# Altium schematic sheet +-15V.SchDoc
size A2
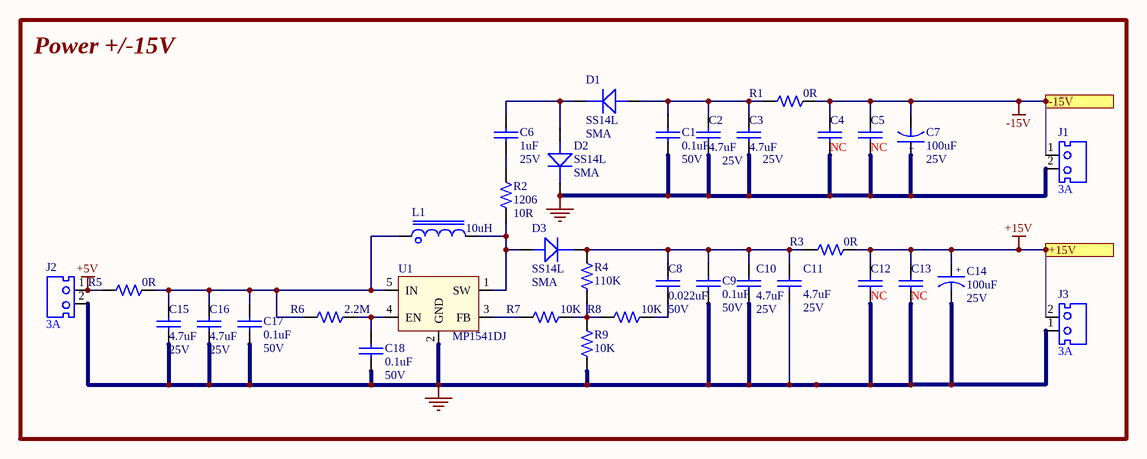
[diagram p0: +-15V.SchDoc]

## Parts
C1  value 0.1uF  Voltage: 50V  [CAPC0603-RW]  (hidden comment: T542021047508)
C2  value 4.7uF  Voltage: 25V  [CAPC0603-RW]  (hidden comment: T542024757408)
C3  value 4.7uF  Voltage: 25V  [CAPC0603-RW]  (hidden comment: T542024757408)
C4  value NC  [CAPC0603-RW]  (hidden comment: T542024757408)
C5  value NC  [CAPC0603-RW]  (hidden comment: CAP0603 NC)
C6  value 1uF  Voltage: 25V  [CAPC1206-RW]  (hidden comment: PZL456450-1050)
C7  value 100uF  Voltage: 25V  [CASE - D8]  (hidden comment: T551101445020)
C8  value 0.022uF  Voltage: 50V  [CAPC0603-RW]  (hidden comment: PXL456470-2230)
C9  value 0.1uF  Voltage: 50V  [CAPC0603-RW]  (hidden comment: T542021047508)
C10  value 4.7uF  Voltage: 25V  [CAPC0603-RW]  (hidden comment: T542024757408)
C11  value 4.7uF  Voltage: 25V  [CAPC0603-RW]  (hidden comment: T542024757408)
C12  value NC  [CAPC0603-RW]  (hidden comment: T542024757408)
C13  value NC  [CAPC0603-RW]  (hidden comment: T542024757408)
C14  value 100uF  Voltage: 25V  [CASE - D8]  (hidden comment: T551101445020)
C15  value 4.7uF  Voltage: 25V  [CAPC0603-RW]  (hidden comment: T542024757408)
C16  value 4.7uF  Voltage: 25V  [CAPC0603-RW]  (hidden comment: T542024757408)
C17  value 0.1uF  Voltage: 50V  [CAPC0603-RW]  (hidden comment: T542021047508)
C18  value 0.1uF  Voltage: 50V  [CAPC0603-RW]  (hidden comment: T542021047508)
D1  MFG Part: SS14L  Package: SMA  [subSMA]  (hidden comment: RCD100140-0010)
D2  MFG Part: SS14L  Package: SMA  [subSMA]  (hidden comment: RCD100140-0010)
D3  MFG Part: SS14L  Package: SMA  [subSMA]  (hidden comment: RCD100140-0010)
J1  Current: 3A  [CONN 2P PH=2.5mm B2B-XH-A]  (hidden comment: CCN250000-0102)
J2  Current: 3A  [CONN 2P PH=2.5mm B2B-XH-A]  (hidden comment: CCN250000-0102)
J3  Current: 3A  [CONN 2P PH=2.5mm B2B-XH-A]  (hidden comment: CCN250000-0102)
L1  value 10uH  [IND CKST0402]  (hidden comment: T621000053100)
R1  value 0R  [0805-RW]  (hidden comment: T502000003009)
R2  value 10R  PACKAGE: 1206  [1206-RW]  (hidden comment: QCF045010-1000)
R3  value 0R  [0805-RW]  (hidden comment: T502000003009)
R4  value 110K  [0603-RW]  (hidden comment: QCF011030-1103)
R5  value 0R  [0805-RW]  (hidden comment: T502000003009)
R6  value 2.2M  [0603-RW]  (hidden comment: QCF011030-2204)
R7  value 10K  [0603-RW]  (hidden comment: QCF011030-1002)
R8  value 10K  [0603-RW]  (hidden comment: QCF011030-1002)
R9  value 10K  [0603-RW]  (hidden comment: QCF011030-1002)
U1  MP1541DJ  [SOT23-5 P.95]

## Blocks framed on the sheet
Power +/-15V: C1-C18 D1-D3 J1-J3 L1 R1-R9 U1

## Ports
+15V, -15V

## Nets
+5V: J2.1 R5.1
+15V: C12.1 C13.1 C14.1 J3.2 R3.2 ; port +15V
-15V: C4.1 C5.1 C7.2 J1.1 R1.2 ; port -15V
GND: C1.2 C2.2 C3.2 C4.2 C5.2 C7.1 C9.2 C10.2 C11.2 C12.2 C13.2 C14.2 C15.2 C16.2 C17.2 C18.2 D2.2(K) J1.2 J2.2 J3.1 R9.1 U1.2(GND)
NetC1_1: C1.1 C2.1 C3.1 D1.1(A) R1.1
NetC6_1: C6.1 D1.2(K) D2.1(A)
NetC6_2: C6.2 R2.2
NetC8_1: C8.1 C9.1 C10.1 C11.1 D3.2(K) R3.1 R4.2
NetC8_2: C8.2 R8.1
NetC15_1: C15.1 C16.1 C17.1 L1.1 R5.2 R6.2 U1.5(IN)
NetC18_1: C18.1 R6.1 U1.4(EN)
NetD3_1: D3.1(A) L1.2 R2.1 U1.1(SW)
NetR4_1: R4.1 R7.1 R8.2 R9.2
NetR7_2: R7.2 U1.3(FB)

## Notes on the sheet
- (in symbol CAP E 100uF 25V 20% SMD_VEJ101M1ETR-0607) +

## Library data of the parts
C1 C9 C17 C18 = CAP0603 0.1uF 50V 10%_X7R: CAP X7R .10UF 50V +-10% 0603 WALSIN L; MFG Part: 0603B104K500; Tolerance: 10%; Type: Capacitor; CREATE_NAME: Nathan; DIP&SMD: SMD; SAP: T542021047508; PACKAGE: CAPC0603; Vendor Name: *; MFG: WALSIN; Other: X7R; CREATE_TIME: 30-Jul-2019; Customer Specific: N/A
C2 C3 C10 C11 C15 C16 = CAP0603 4.7uF 25V 10%_X7R_WALSIN: CAP X7R 4.7UF 25V +-10% 0603 WALSIN L; Tolerance: 10%; Type: Capacitor; CREATE_NAME: Nathan; DIP&SMD: SMD; SAP: T542024757408; PACKAGE: CAPC0603; Vendor Name: *; MFG: WALSIN; MFG Part: *; Other: X7R; CREATE_TIME: 13-July-2016; Customer Specific: N/A
C4 C5 C12 C13 = CAP0603 NC: NC; Type: Capacitor; CREATE_NAME: Tom; DIP&SMD: SMD; SAP: *; PACKAGE: CAPC0603; Vendor Code: *; Vendor Name: *; MFG: *; MFG Part: *; Other: *; Tolerance: *; CREATE_TIME: 18-Mar-2016; Customer Specific: N/A; Voltage: *
C6 = CAPC1206 1uF 25V 10% - PZL456450-1050: GP CHIP CAP  1uF 25V 10%; SAP: T542041057408; Vendor Code: 10010262; Vendor Name: 东莞市晴远电子有限公司; Type: Capacitor; DIP&SMD: SMD; PACKAGE: CAPC1206; MFG: *; MFG Part: *; Other: *; Tolerance: 10%; Customer Specific: N/A
C7 C14 = CAP E 100uF 25V 20% SMD_VEJ101M1ETR-0607: E 100UF 25V +-20% 6.3X7. VEJ101M1E K; MFG: LELON; Tolerance: 20%; Type: Capacitor; CREATE_NAME: Nathan; DIP&SMD: SMD; SAP: T551101445020; PACKAGE: CASE - C7.7; Vendor Name: *; Vendor Code: *; MFG Part: VEJ101M1ETR-0607; Other: *; CREATE_TIME: 01-Mar-2019; Customer Specific: N/A
C8 = CAP0603 0.022uF 50V 10%: GP CHIP CAP 0.022uF 50V 10%; SAP: T542022237508; Vendor Code: 10010262; Vendor Name: 东莞市晴远电子有限公司; Type: Capacitor; DIP&SMD: SMD; PACKAGE: CAPC0603; MFG: *; MFG Part: *; Other: *; Tolerance: 10%; Customer Specific: N/A
D1-D3 = SS14L-TSC: SMD Schottky Diode Sub SMA 1A 40V SS14L; MFG: TSC; SAP: T571000130604; Vendor Code: *; Vendor Name: *; Type: DIODE; DIP&SMD: SMD; Customer Specific: N/A; Voltage: 40V; Current: 1A
J1-J3 = CONN 2P PH=2.5mm B2B-XH-A: GP CONNECTOR B2B-XH-A 2 PIN G; MFG Part: HAA250A-2A-WHITE; Value: 2.5mm; SAP: T690300041200; MFG: 金瑞康; Vendor Name: 亿源电子有限公司; Vendor Code: 10009989; DIP&SMD: DIP; Type: Connector
L1 = IND 10uH CKST0402-10uH/M: 10UH 2A 100K SMD CENKER CKST040 K; Type: INDUCTOR; CREATE_NAME: Nathan; Irms: 1.6A; DCR: 294mΩ; SAP: T621000053100; MFG: CENKER; Vendor Code: *; Vendor Name: *; CREATE_TIME: 27-Sep-2017; MFG Part: CKST0402-10uH/M; Isat: 2A; DIP&SMD: SMD
R1 R3 R5 = RES0805 1/8W  0 OHM_WALSIN: CHIP 0 OHM 0 OHM 0 OHM 0805 WALSI L; Power: 1/8W; MFG: WALSIN; CREATE_Name: Tom; DIP&SMD: SMD; Vendor Code: *; SAP: T502000003009; Vendor Name: *; MFG Part: *; TOL: *; Type: Resistor; CREATE_Time: 27-Jun-2018; PACKAGE: 0805; Customer Specific: N/A
R2 = RES1206 1/4W 5% 10 OHM: CHIP 10 OHM 100PPM +-5% 1206 WALS L; Vendor Code: 10010262; SAP: T502010004499; Power: 1/4W; Vendor Name: 东莞市晴远电子有限公司; MFG: WALSIN (華新); TOL: 5%; DIP&SMD: SMD; MFG Part: *; Type: Resistor; Customer Specific: N/A
R4 = RES0603 1/10W 1% 110K OHM: CHIP RES 110K OHM 1/10W 1% 0603; Vendor Code: 10010262; SAP: T502110302399; Vendor Name: 东莞市晴远电子有限公司; DIP&SMD: SMD; Power: 1/10W; MFG Part: *; MFG: *; TOL: 1%; Type: Resistor; PACKAGE: 0603; Customer Specific: N/A
R6 = RES0603 1/10W 1% 2.2M OHM: GP CHIP RES. 2.2M OHM 1/10W 1% 0603; Vendor Code: 10010262; SAP: T502220402399; Vendor Name: 东莞市晴远电子有限公司; DIP&SMD: SMD; Power: 1/10W; MFG Part: *; MFG: *; TOL: 1%; Type: Resistor; PACKAGE: 0603; Customer Specific: N/A
R7-R9 = RES0603 1/10W 1% 10K OHM: GP CHIP RES. 10K OHM 1/10W 1% 0603; Vendor Code: 10010262; SAP: T502100202399; Vendor Name: 东莞市晴远电子有限公司; DIP&SMD: SMD; Power: 1/10W; MFG Part: *; MFG: *; TOL: 1%; Type: Resistor; PACKAGE: 0603; Customer Specific: N/A
U1 = MP1541DJ: MFG: MPS; CREATE_NAME: Tom; DIP&SMD: SMD; CREATE_TIME: 06-Nov-2019; SAP: *; Value: *; Type: IC; Customer Specific: N/A; MFG Part: MP1541DJ